# EAGLE design Base Station (EAGLE 7.3.0)
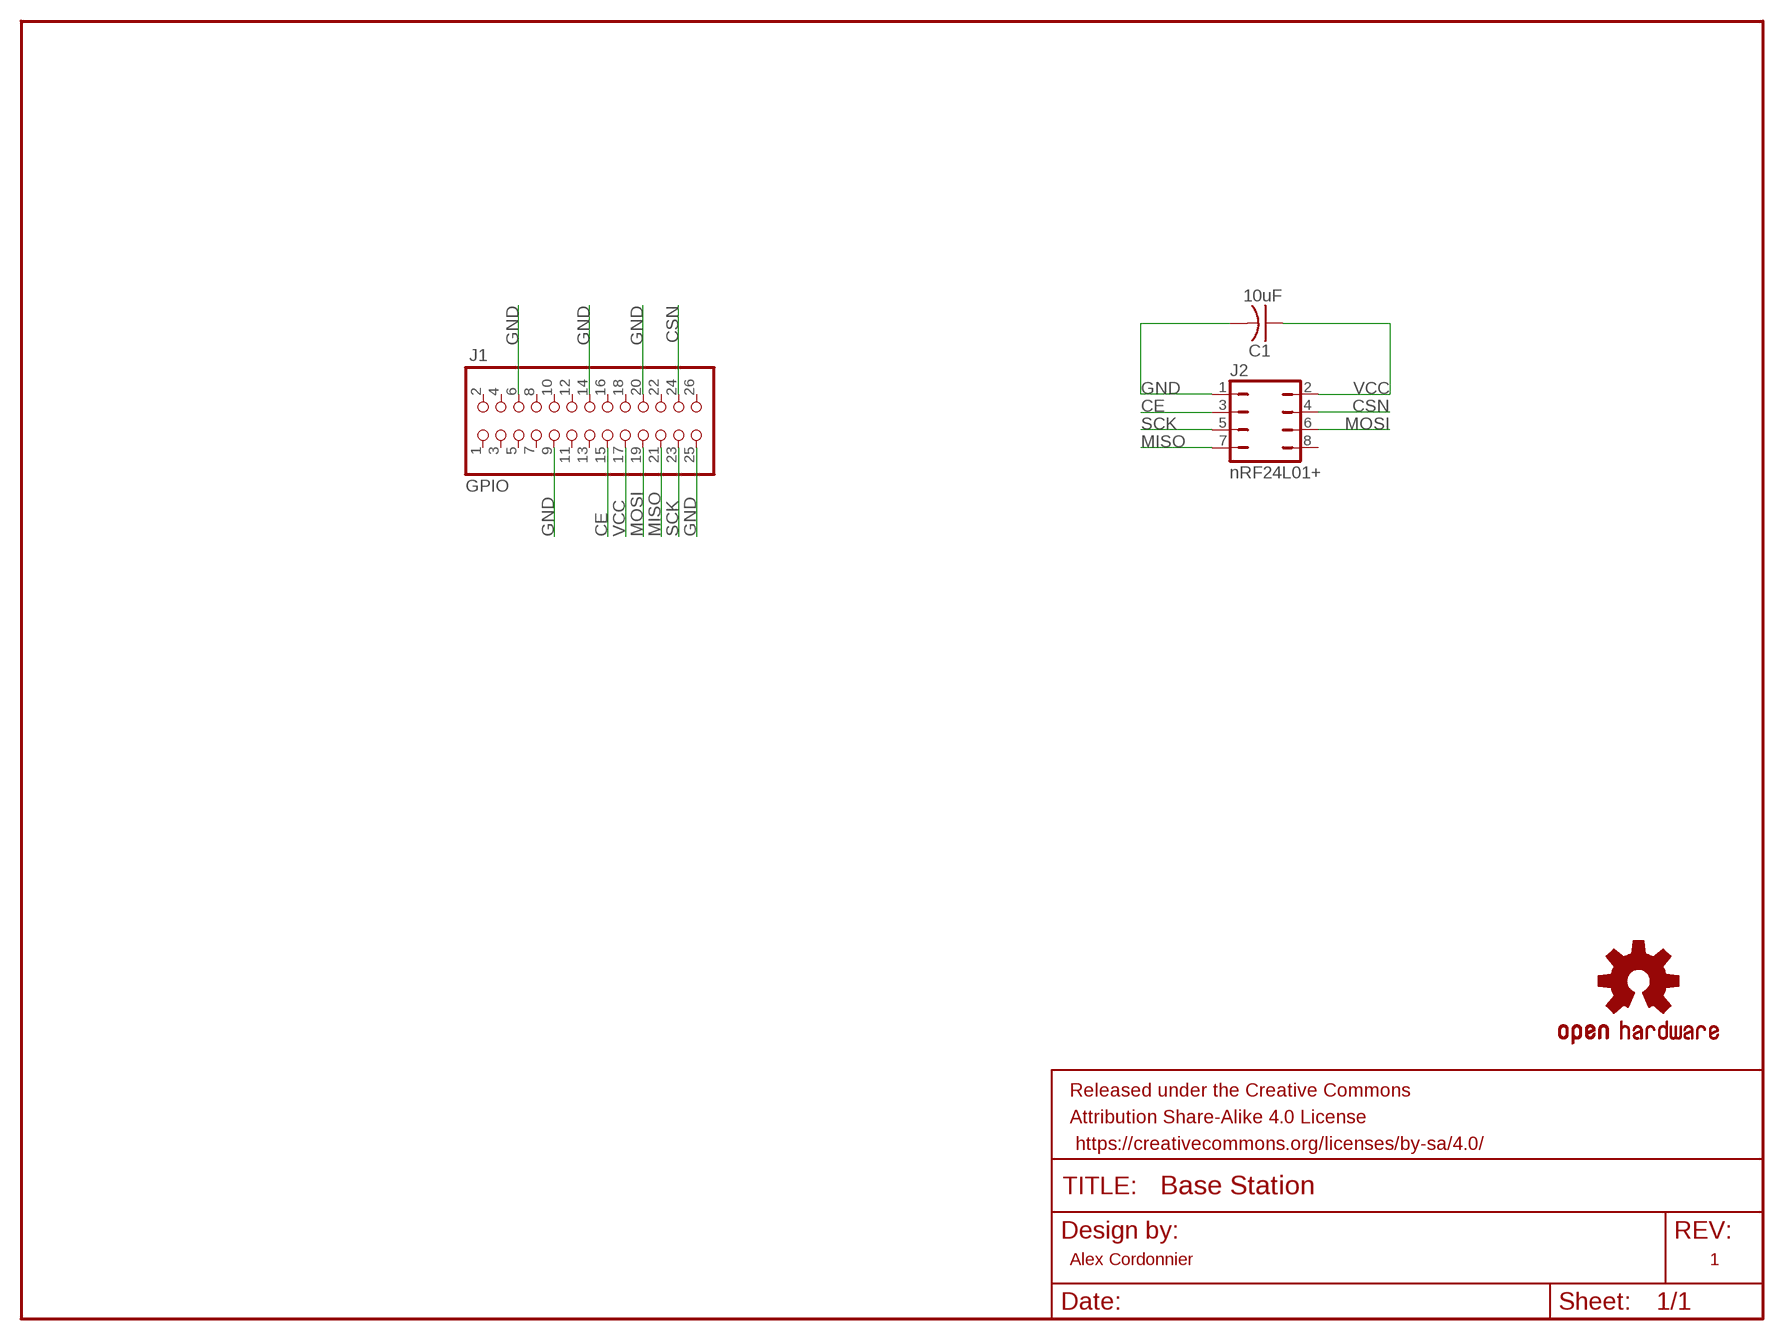
[diagram p0: schematic, sheet 1]

## Parts
C1  10uF  C-USC1206K  [C1206K]
FRAME1  FRAME-LETTERNO_PACKAGE  [DUMMY]
J1  GPIO  PINHD-2X13  [2X13]
J2  nRF24L01+  FEMALE-2X4-SMT  [FEMALE-2X4-SMT]
LOGO1  OSHW-LOGOS  [OSHW-LOGO-S]

## Nets
CE: J1.15 J2.3
CSN: J1.24 J2.4
GND: C1.2 J1.6 J1.9 J1.14 J1.20 J1.25 J2.1
MISO: J1.21 J2.7
MOSI: J1.19 J2.6
SCK: J1.23 J2.5
VCC: C1.1 J1.17 J2.2
Unconnected: J1.1 J1.2 J1.3 J1.4 J1.5 J1.7 J1.8 J1.10 J1.11 J1.12 J1.13 J1.16 J1.18 J1.22 J1.26 J2.8

## Notes on the sheet
- Alex Cordonnier | 1

## Library data of the parts
C1 = rcl:C-US: CAPACITOR, American symbol
FRAME1 = SparkFun-Aesthetics:FRAME-LETTER: Schematic Frame Standard 8.5x11 US Letter frame; DESIGNER: Nobody; VERSION: v01
J1 = pinhead:PINHD-2X13: PIN HEADER
J2 = my-custom:FEMALE-2X4-SMT: 2x4 female SMT header http://www.digikey.com/product-detail/en/NPPC042KFMS-RC/S5713-ND/776172
LOGO1 = SparkFun-Aesthetics:OSHW-LOGO: Open Source Hardware Logo This logo indicates the piece of hardware it is found on incorporates a OSHW license and/or adheres to the definition of open source hardware found here: http://freedomdefined.org/OSHW

## Board
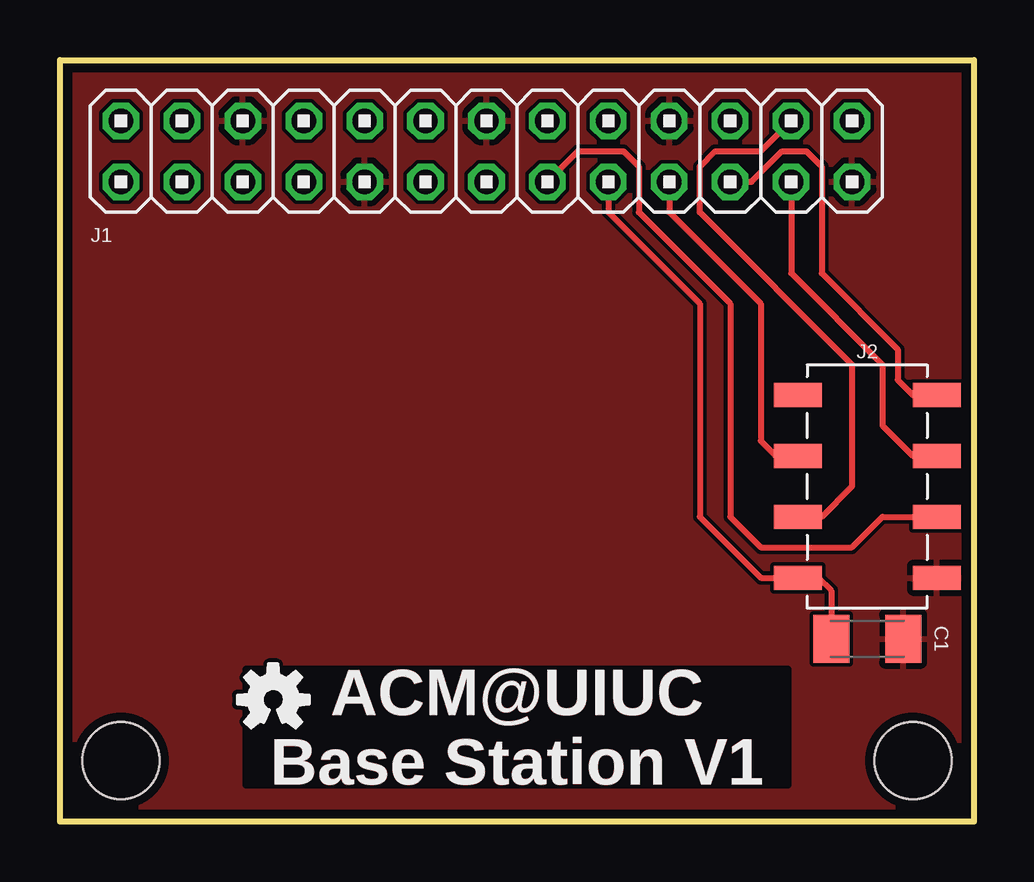
[diagram p1: board, top side]

Size 38.1 x 31.75 mm. Coordinates in mm from the lower left corner, seen from the top.
Outline: 0,31.75 38.1,31.75 38.1,0 0,0 0,31.75
Copper layers (1*16): Top 0.0356mm / dielectric 1.5011mm / Bottom 0.0356mm
Design rules "OSHPark": minimum track width 6mil, minimum drill 13mil, track to track 6mil, track to pad 6mil, pad to pad 6mil, via to via 6mil, smd to smd 6mil, copper to edge 15mil, drill to drill 6mil, minimum pad ring 7mil, minimum via ring 7mil, stop-mask expansion 3mil, vias tented up to drill 0mil, thermal gap 10mil
Holes 3.2 mm at 2.54,2.54 35.56,2.54

### Footprints (pad centres in the part's own frame; a part is rotated, then mirrored left to right if it is on the bottom)
C1206K = smd 1.5 x 2: 1 -1.5,0; 2 1.5,0
2X13 = drill 1.016 octagon: 1 -15.24,-1.27; 2 -15.24,1.27; 3 -12.7,-1.27; 4 -12.7,1.27; 5 -10.16,-1.27; 6 -10.16,1.27; 7 -7.62,-1.27; 8 -7.62,1.27; 9 -5.08,-1.27; 10 -5.08,1.27; 11 -2.54,-1.27; 12 -2.54,1.27; 13 0,-1.27; 14 0,1.27; 15 2.54,-1.27; 16 2.54,1.27; 17 5.08,-1.27; 18 5.08,1.27; 19 7.62,-1.27; 20 7.62,1.27; 21 10.16,-1.27; 22 10.16,1.27; 23 12.7,-1.27; 24 12.7,1.27; 25 15.24,-1.27; 26 15.24,1.27
FEMALE-2X4-SMT = smd 1 x 2: 1 -3.81,-2.9; 2 -3.81,2.9; 3 -1.27,-2.9; 4 -1.27,2.9; 5 1.27,-2.9; 6 1.27,2.9; 7 3.81,-2.9; 8 3.81,2.9

### Placement (x,y rotation side)
C1  33.66,7.62 0 top
FRAME1  0,0 0 top
J1  17.78,27.94 0 top
J2  33.66,13.97 90 top
LOGO1  8.89,5.08 0 top
U$1  [OSHW-LOGO-S_COPPER]  8.89,5.08 0 top

### Tracks (layer width: path | path; a pad name or v marks a point on that pad's centre or on a via)
CE
  Top 0.254: J1.15 21.59,27.94 23.5,27.94 24.13,27.3 24.13,25.4 27.94,21.59 27.94,12.7 29.21,11.43 33.02,11.43 34.29,12.7 J2.3
CSN
  Top 0.254: J1.24 29.21,27.94 27.3,27.94 26.67,27.3 26.67,25.4 33.02,19.05 33.02,13.97 31.75,12.7 J2.4
GND
  pour Top: 0,31.75 38.1,31.75 38.1,0 0,0
MISO
  Top 0.254: J1.21 28.83,26.67 30.1,27.94 31.11,27.94 31.75,27.3 31.75,22.86 34.92,19.68 34.92,18.41 35.56,17.78 J2.7
MOSI
  Top 0.254: J1.19 25.4,25.4 29.21,21.59 29.21,15.88 29.84,15.24 J2.6
SCK
  Top 0.254: J1.23 30.48,22.86 34.29,19.05 34.29,16.51 35.56,15.24 J2.5
VCC
  Top 0.254: J1.17 22.86,25.4 26.67,21.59 26.67,12.7 29.21,10.16 J2.2 31.62,10.16 32.16,9.63 C1.1

### Text on the board
Top: ACM@UIUC / Base Station V1
tPlace: ACM@UIUC / Base Station V1